# Altium schematic sheet nrf.SchDoc
size A4; SheetNumber: 5; SheetTotal: 8
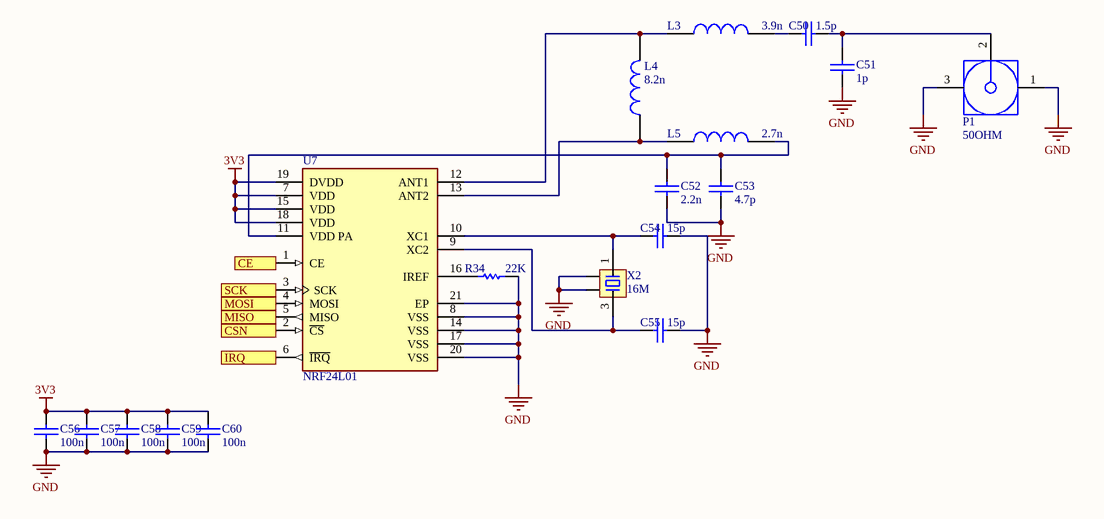
[diagram p0: nrf.SchDoc]

## Parts
C50  1.5p  [0603C]
C51  1p  [0603C]
C52  2.2n  [0603C]
C53  4.7p  [0603C]
C54  15p  [0603C]
C55  15p  [0603C]
C56  100n  [0603C]
C57  100n  [0603C]
C58  100n  [0603C]
C59  100n  [0603C]
C60  100n  [0603C]
L3  3.9n  [0603L]
L4  8.2n  [0603L]
L5  2.7n  [0603L]
P1  50OHM  [IPEX]
R34  22K  [0603R]
U7  NRF24L01  [FP-NRF24L01-IPC_C]
X2  16M  [OSC 3225-4P]

## Ports
CE (in), CSN (in), IRQ (out), MISO (out), MOSI (in), SCK (in)

## Nets
3V3: C56.2 C57.2 C58.2 C59.2 C60.2 U7.7(VDD) U7.15(VDD) U7.18(VDD) U7.19(DVDD)
GND: C51.2 C52.1 C53.1 C54.1 C55.1 C56.1 C57.1 C58.1 C59.1 C60.1 P1.1 P1.3 R34.2 U7.8(VSS) U7.14(VSS) U7.17(VSS) U7.20(VSS) U7.21(EP) X2.2 X2.4
CE: U7.1(CE) ; port CE
CSN: U7.2(~{CS}) ; port CSN
IRQ: U7.6(~{IRQ}) ; port IRQ
MISO: U7.5(MISO) ; port MISO
MOSI: U7.4(MOSI) ; port MOSI
SCK: U7.3(SCK) ; port SCK
NetC50_1: C50.1 C51.1 P1.2
NetC50_2: C50.2 L3.2
NetC52_2: C52.2 C53.2 L5.2 U7.11(VDD_PA)
NetC54_2: C54.2 U7.10(XC1) X2.1
NetC55_2: C55.2 U7.9(XC2) X2.3
NetL3_1: L3.1 L4.2 U7.12(ANT1)
NetL4_1: L4.1 L5.1 U7.13(ANT2)
NetR34_1: R34.1 U7.16(IREF)

## Library data of the parts
C50-C60 = CAP: 无极性电容
L3-L5 = INDUCTOR
P1 = IPEX: RF Coaxial PCB Connector, MCX; Thru-Hole, Right-Angle Mount Socket, Blunt Post Terminal, 50 Ohm Impedance; PCB_Layout: Complies with manufacturer's recommendation.; DrillSize: Corresponds to nominal value.; Published: 15-Jul-2004; LatestRevisionDate: 15-Jul-2004; LatestRevisionNote: Component Replaced.; DatasheetDocument: 30-May-2003; PackageDocument: 04-Jul-1999; PackageReference: 919-119J-51AX; Publisher: Altium Limited; ComponentLink1Description: Manufacturer Link; ComponentLink1URL: http://www.amphenolrf.com/
R34 = RES
U7 = CMP-228436-000003-1: IC RF TXRX ISM>1GHZ 20VFQFN
X2 = XTAL-4P: 4脚无源晶振